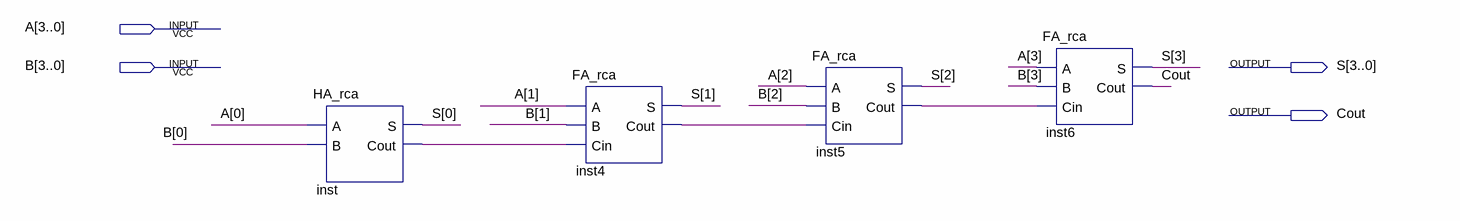
[diagram p0: schematic sheet]
// Quartus schematic RCA.bdf as structural Verilog: 4 symbols, 4 pins
module RCA (
  input  [3:0] A,
  input  [3:0] B,
  output [3:0] S,
  output Cout
);

  wire inst4_cout, inst5_cout, inst_cout;

  HA_rca inst (.A(A[0]), .B(B[0]), .S(S[0]), .Cout(inst_cout));
  FA_rca inst4 (.A(A[1]), .B(B[1]), .Cin(inst_cout), .S(S[1]), .Cout(inst4_cout));
  FA_rca inst5 (.A(A[2]), .B(B[2]), .Cin(inst4_cout), .S(S[2]), .Cout(inst5_cout));
  FA_rca inst6 (.A(A[3]), .B(B[3]), .Cin(inst5_cout), .S(S[3]), .Cout(Cout));
endmodule
